# Altium project SynthyTwo.Project.PrjPcb
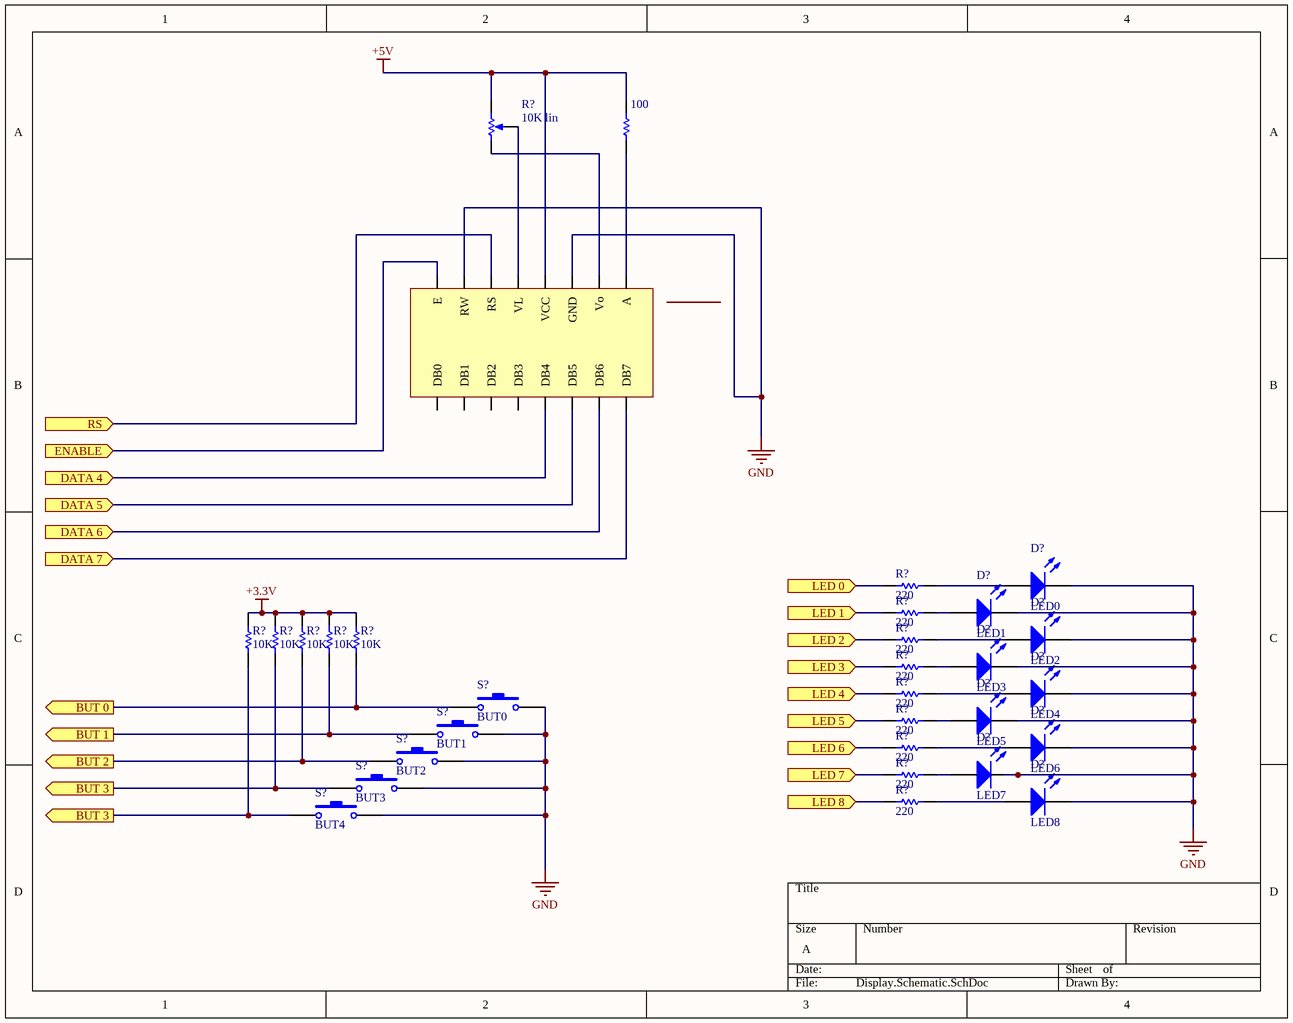
[diagram p0: Display.Schematic.SchDoc]
7 sheets, 207 parts. Net scope: flat (ports and power ports of the same name join across sheets).
Sheets:
  Display.Schematic.SchDoc
  FilterBoard.Schematic.SchDoc
  Output.Schematic.SchDoc
  FilterControl.Schematic.SchDoc
  DAC.Schematic.SchDoc
  MIDI.Schematic.SchDoc
  Encodeurs.Schematic.SchDoc

## Sheet Display.Schematic.SchDoc
size A

### Parts
(Parts that share a designator on the sheet are numbered #1, #2 ... from top to bottom, then left to right.)
*#1  16x2 LCD  (value not drawn)
D?#1  LED0  [LED-0]
D?#2  LED1  [LED-0]
D?#3  LED2  [LED-0]
D?#4  LED3  [LED-0]
D?#5  LED4  [LED-0]
D?#6  LED5  [LED-0]
D?#7  LED6  [LED-0]
D?#8  LED7  [LED-0]
D?#9  LED8  [LED-0]
R?#1  10K lin  [VR5]
R?#2  100  [AXIAL-0.3]
R?#3  220  [AXIAL-0.3]
R?#4  220  [AXIAL-0.3]
R?#5  220  [AXIAL-0.3]
R?#6  10K  [AXIAL-0.3]
R?#7  10K  [AXIAL-0.3]
R?#8  10K  [AXIAL-0.3]
R?#9  10K  [AXIAL-0.3]
R?#10  10K  [AXIAL-0.3]
R?#11  220  [AXIAL-0.3]
R?#12  220  [AXIAL-0.3]
R?#13  220  [AXIAL-0.3]
R?#14  220  [AXIAL-0.3]
R?#15  220  [AXIAL-0.3]
R?#16  220  [AXIAL-0.3]
S?#1  BUT0  [SPST-2]
S?#2  BUT1  [SPST-2]
S?#3  BUT2  [SPST-2]
S?#4  BUT3  [SPST-2]
S?#5  BUT4  [SPST-2]

### Ports
BUT 0 (out), BUT 1 (out), BUT 2 (out), BUT 3 (out), DATA 4 (in), DATA 5 (in), DATA 6 (in), DATA 7 (in), ENABLE (in), LED 0 (in), LED 1 (in), LED 2 (in), LED 3 (in), LED 4 (in), LED 5 (in), LED 6 (in), LED 7 (in), LED 8 (in), RS (in)

### Nets
+3.3V: R?#6.2 R?#7.2 R?#8.2 R?#9.2 R?#10.2
+5V: *#1.2(VCC) R?#1.2(BOT) R?#2.2
GND: *#1.1(GND) *#1.5(RW) D?#1.2(K) D?#2.2(K) D?#3.2(K) D?#4.2(K) D?#5.2(K) D?#6.2(K) D?#7.2(K) D?#8.2(K) D?#9.2(K) S?#1.2 S?#2.2 S?#3.2 S?#4.2 S?#5.2
Net*#1_3: *#1.3(VL) R?#1.3(TAP)
Net*#1_4: *#1.4(RS) ; port RS
Net*#1_6: *#1.6(E) ; port ENABLE
Net*#1_7: *#1.7(DB7) ; port DATA 7
Net*#1_8: *#1.8(DB6) ; port DATA 6
Net*#1_9: *#1.9(DB5) ; port DATA 5
Net*#1_10: *#1.10(DB4) ; port DATA 4
Net*#1_15: *#1.15(Vo) R?#1.1(TOP)
Net*#1_16: *#1.16(A) R?#2.1
NetD?#1_1: D?#1.1(A) R?#3.2
NetD?#2_1: D?#2.1(A) R?#4.2
NetD?#3_1: D?#3.1(A) R?#5.2
NetD?#4_1: D?#4.1(A) R?#11.2
NetD?#5_1: D?#5.1(A) R?#12.2
NetD?#6_1: D?#6.1(A) R?#13.2
NetD?#7_1: D?#7.1(A) R?#14.2
NetD?#8_1: D?#8.1(A) R?#15.2
NetD?#9_1: D?#9.1(A) R?#16.2
NetR?#3_1: R?#3.1 ; port LED 0
NetR?#4_1: R?#4.1 ; port LED 1
NetR?#5_1: R?#5.1 ; port LED 2
NetR?#6_1: R?#6.1 R?#7.1 S?#4.1 S?#5.1 ; port BUT 3
NetR?#8_1: R?#8.1 S?#3.1 ; port BUT 2
NetR?#9_1: R?#9.1 S?#2.1 ; port BUT 1
NetR?#10_1: R?#10.1 S?#1.1 ; port BUT 0
NetR?#11_1: R?#11.1 ; port LED 3
NetR?#12_1: R?#12.1 ; port LED 4
NetR?#13_1: R?#13.1 ; port LED 5
NetR?#14_1: R?#14.1 ; port LED 6
NetR?#15_1: R?#15.1 ; port LED 7
NetR?#16_1: R?#16.1 ; port LED 8

Not connected (* = marked no-connect by the designer): *#1 11(DB3) 12(DB2) 13(DB1) 14(DB0)

### Library data of the parts
*#1 = Display
D?#1-D?#9 = LED0: Typical INFRARED GaAs LED; Published: 8-Jun-2000; LatestRevisionDate: 08-Jul-2005; LatestRevisionNote: Mech Layer 1 removed.; PackageReference: LED-0; Publisher: Altium Limited; PackageDescription: LED; 2 Leads
R?#1 = RPot: Potentiometer; Sim Note: Enter the Resistance value and the set point into parameter fields.; Set Position: 0.5; Published: 8-Jun-2000; LatestRevisionDate: 17-Jul-2002; LatestRevisionNote: Re-released for DXP Platform.; PackageReference: VR5; Publisher: Altium Limited; PackageDescription: Variable Resistor, Thru-Hole; 3 Leads; Value: 10K
R?#2-R?#4 R?#6-R?#10 = Res1: Resistor; Value: 1K; Published: 8-Jun-2000; LatestRevisionDate: 17-Jul-2002; LatestRevisionNote: Re-released for DXP Platform.; PackageReference: AXIAL-0.3; Publisher: Altium Limited; PackageDescription: Axial Device, Thru-Hole; 2 Leads; 0.3 in Pin Spacing
R?#5 R?#11-R?#16 = Res1: Resistor; Published: 8-Jun-2000; LatestRevisionDate: 17-Jul-2002; LatestRevisionNote: Re-released for DXP Platform.; PackageReference: AXIAL-0.3; Publisher: Altium Limited; PackageDescription: Axial Device, Thru-Hole; 2 Leads; 0.3 in Pin Spacing; Value: 220
S?#1-S?#5 = SW-PB: Switch; Published: 24-Mar-1999; LatestRevisionDate: 17-Jul-2002; LatestRevisionNote: Re-released for DXP Platform.; PackageReference: SPST-2; Publisher: Altium Limited; PackageDescription: Switch; 2 Leads

## Sheet FilterBoard.Schematic.SchDoc
size B
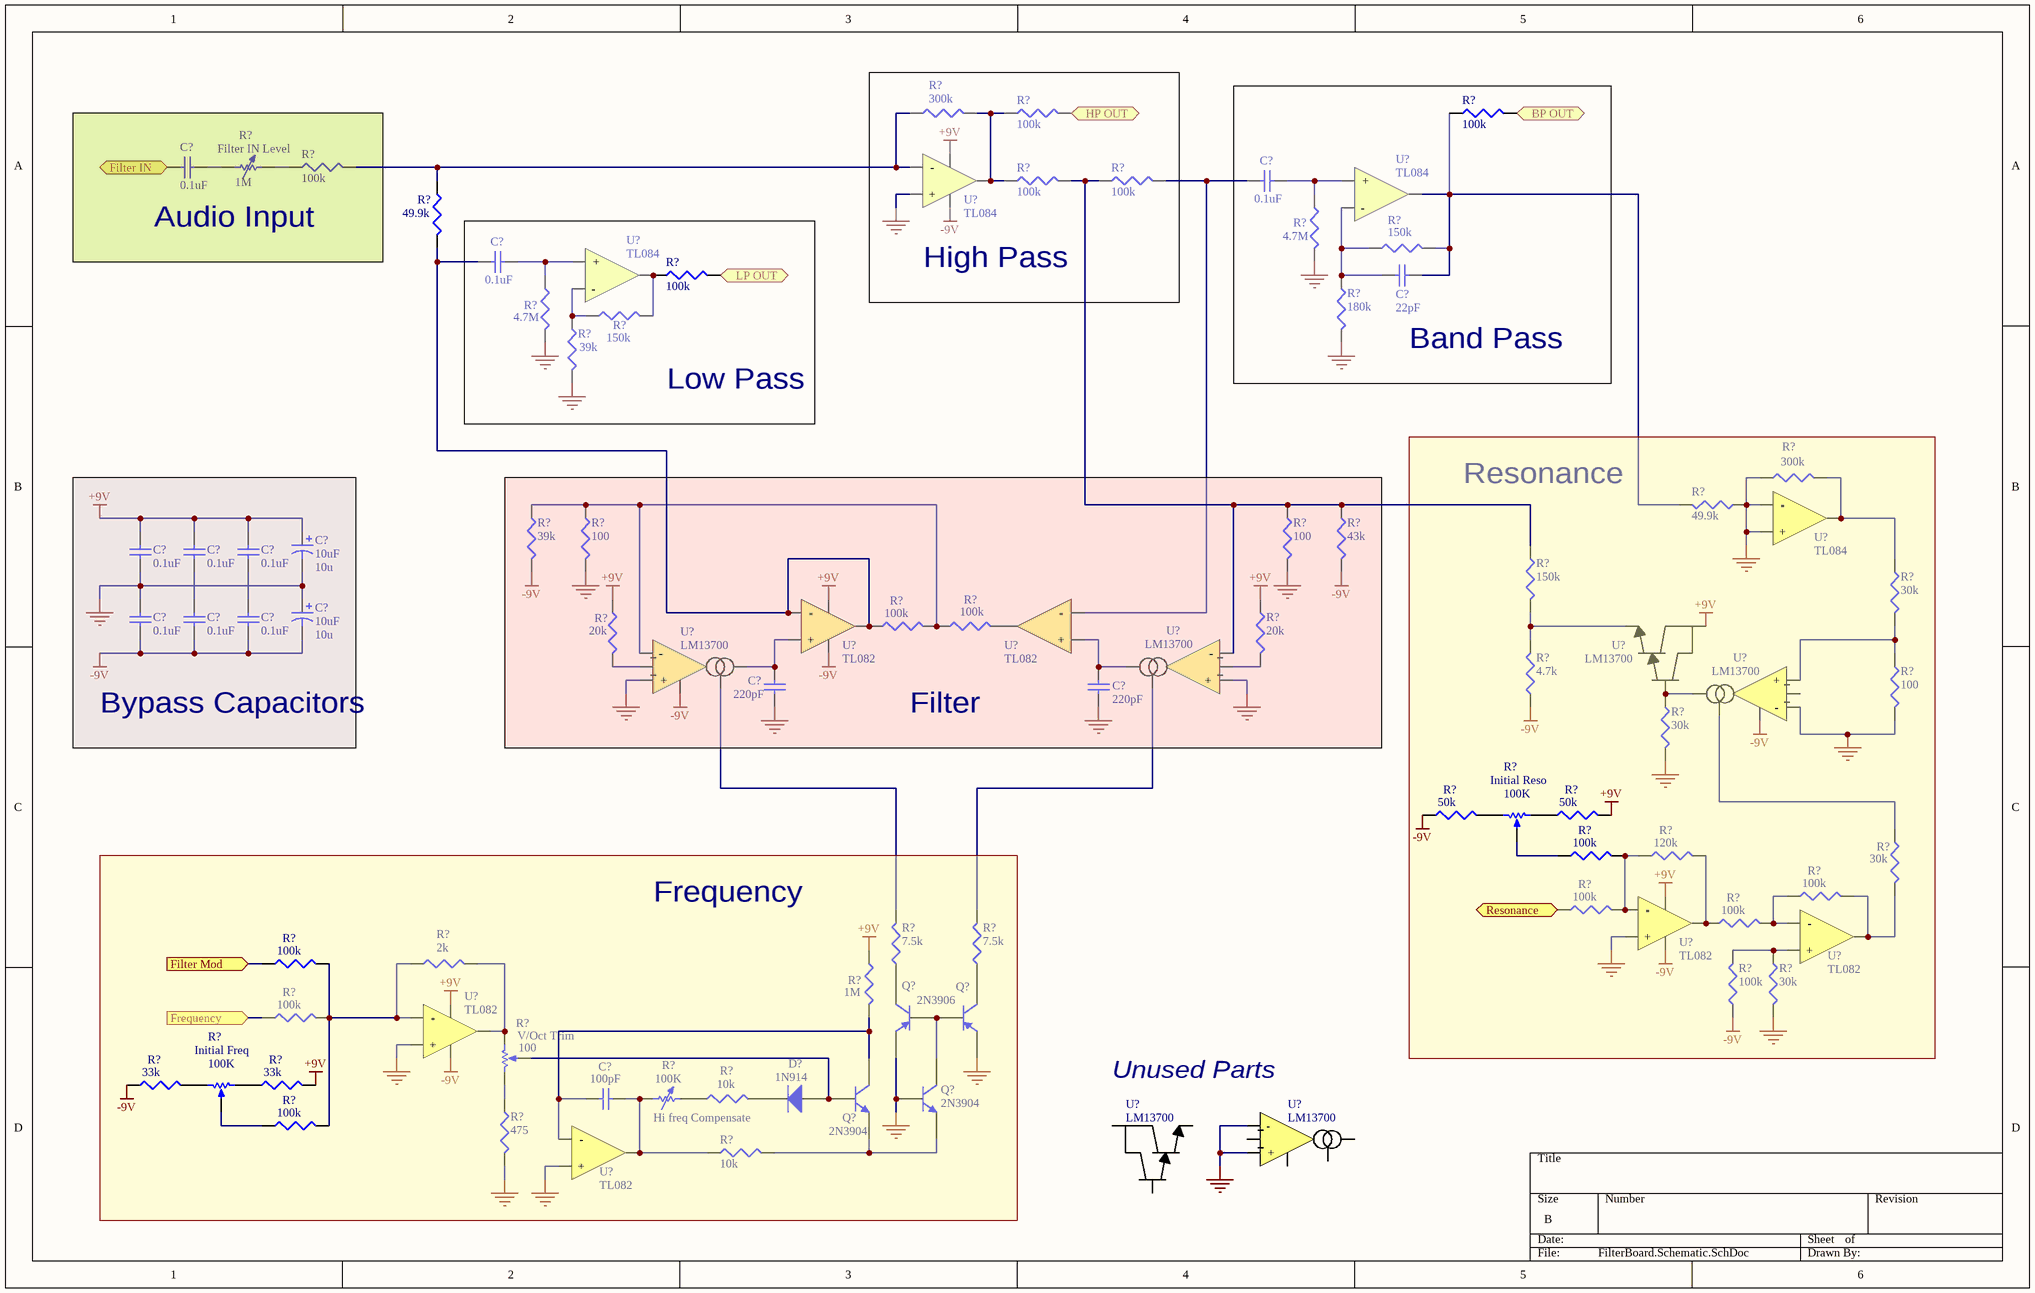
[diagram p1: FilterBoard.Schematic.SchDoc]

### Parts
(Parts that share a designator on the sheet are numbered #1, #2 ... from top to bottom, then left to right.)
C?#1  0.1uF  [C1206]
C?#2  0.1uF  [C1206]
C?#3  0.1uF  [C1206]
C?#4  22pF  [C1206]
C?#5  10uF  value 10u  [RB7.6-15]
C?#6  0.1uF  [C1206]
C?#7  0.1uF  [C1206]
C?#8  0.1uF  [C1206]
C?#9  10uF  value 10u  [RB7.6-15]
C?#10  0.1uF  [C1206]
C?#11  0.1uF  [C1206]
C?#12  0.1uF  [C1206]
C?#13  220pF  [C1206]
C?#14  220pF  [C1206]
C?#15  100pF  [C1206]
D?#10  1N914  [DO-41]
Q?#1  2N3906  [TO-92A]
Q?#2  2N3906  [TO-92A]  (value not drawn)
Q?#3  2N3904  [TO-92A]
Q?#4  2N3904  [TO-92A]
R?#17  300k  [J1-0603]
R?#18  100k  [J1-0603]
R?#19  100k  [J1-0603]
R?#20  Filter IN Level  value 1M  [AXIAL-0.7]
R?#21  100k  [J1-0603]
R?#22  100k  [J1-0603]
R?#23  100k  [J1-0603]
R?#24  49.9k  [J1-0603]
R?#25  4.7M  [J1-0603]
R?#26  150k  [J1-0603]
R?#27  100k  [J1-0603]
R?#28  4.7M  [J1-0603]
R?#29  180k  [J1-0603]
R?#30  150k  [J1-0603]
R?#31  39k  [J1-0603]
R?#32  300k  [J1-0603]
R?#33  39k  [J1-0603]
R?#34  100  [J1-0603]
R?#35  100  [J1-0603]
R?#36  43k  [J1-0603]
R?#37  49.9k  [J1-0603]
R?#38  150k  [J1-0603]
R?#39  30k  [J1-0603]
R?#40  20k  [J1-0603]
R?#41  100k  [J1-0603]
R?#42  100k  [J1-0603]
R?#43  20k  [J1-0603]
R?#44  100  [J1-0603]
R?#45  4.7k  [J1-0603]
R?#46  30k  [J1-0603]
R?#47  50k  [J1-0603]
R?#48  50k  [J1-0603]
R?#49  Initial Reso  value 100K  [VR5]
R?#50  100k  [J1-0603]
R?#51  120k  [J1-0603]
R?#52  30k  [J1-0603]
R?#53  100k  [J1-0603]
R?#54  100k  [J1-0603]
R?#55  100k  [J1-0603]
R?#56  100k  [J1-0603]
R?#57  2k  [J1-0603]
R?#58  7.5k  [J1-0603]
R?#59  1M  [J1-0603]
R?#60  7.5k  [J1-0603]
R?#61  30k  [J1-0603]
R?#62  100k  [J1-0603]
R?#63  100k  [J1-0603]
R?#64  V/Oct Trim  value 100  [VR5]
R?#65  33k  [J1-0603]
R?#66  33k  [J1-0603]
R?#67  Hi freq Compensate  value 100K  [AXIAL-0.7]
R?#68  10k  [J1-0603]
R?#69  Initial Freq  value 100K  [VR5]
R?#70  100k  [J1-0603]
R?#71  475  [J1-0603]
R?#72  10k  [J1-0603]
U?#1  TL084
U?#2  TL084
U?#3  TL084
U?#4  TL084
U?#5  TL082
U?#6  TL082
U?#7  LM13700
U?#8  LM13700
U?#9  LM13700
U?#10  LM13700
U?#11  TL082
U?#12  TL082
U?#13  TL082
U?#14  LM13700
U?#15  TL082
U?#16  LM13700

### Blocks framed on the sheet
Audio Input: C?#1 R?#20 R?#21
High Pass: R?#17 R?#18 R?#22 R?#23 U?#1
Band Pass: C?#2 C?#4 R?#19 R?#25 R?#26 R?#29 U?#2
Low Pass: C?#3 R?#27 R?#28 R?#30 R?#31 U?#3
Resonance: R?#32 R?#37-R?#39 R?#44-R?#55 R?#61 R?#63 U?#4 U?#9-U?#12
Bypass Capacitors: C?#5-C?#12
Filter: C?#13 C?#14 R?#33-R?#36 R?#40-R?#43 U?#5-U?#8
Frequency: C?#15 D?#10 Q?#1-Q?#4 R?#56-R?#60 R?#62 R?#64-R?#72 U?#13 U?#15

### Ports
BP OUT (out), Filter IN (in), Filter Mod (in), Frequency (in), HP OUT (out), LP OUT (out), Resonance (in)

### Nets
+9V: C?#5.1 C?#6.2 C?#7.2 C?#8.2 R?#40.1 R?#43.1 R?#48.2 R?#59.1 R?#66.2 U?#1.4(VCC+) U?#5.8(VCC+) U?#9.11(V+) U?#11.8(VCC+) U?#13.8(VCC+)
-9V: C?#9.2 C?#10.1 C?#11.1 C?#12.1 R?#33.2 R?#36.2 R?#45.1 R?#47.1 R?#63.1 R?#65.1 U?#1.11(VCC-) U?#5.4(VCC-) U?#7.6(VCC-) U?#10.6(VCC-) U?#11.4(VCC-) U?#13.4(VCC-)
GND: C?#5.2 C?#6.1 C?#9.1 C?#10.2 C?#13.1 C?#14.1 Q?#1.1(E) Q?#2.1(E) Q?#4.2(B) R?#25.2 R?#28.2 R?#29.2 R?#31.2 R?#32.1 R?#34.2 R?#35.2 R?#37.1 R?#44.2 R?#46.2 R?#61.2 R?#71.2 U?#1.3(+) U?#4.12(-) U?#4.13(+) U?#7.3(+) U?#8.3(+) U?#10.3(-) U?#11.3(+) U?#13.3(+) U?#14.3(+) U?#14.4(-) U?#15.5(+)
NetC?#1_1: C?#1.1 ; port Filter IN
NetC?#1_2: C?#1.2 R?#20.1
NetC?#2_1: C?#2.1 R?#23.2 U?#6.6(-)
NetC?#2_2: C?#2.2 R?#25.1 U?#2.5(+)
NetC?#3_1: C?#3.1 R?#24.2 R?#41.1 U?#5.1(OUT) U?#5.2(-)
NetC?#3_2: C?#3.2 R?#28.1 U?#3.5(+)
NetC?#4_1: C?#4.1 R?#26.1 R?#29.1 U?#2.3(-)
NetC?#4_2: C?#4.2 R?#19.1 R?#26.2 R?#37.2 U?#2.7(OUT)
NetC?#7_1: C?#7.1 C?#11.2
NetC?#8_1: C?#8.1 C?#12.2
NetC?#13_2: C?#13.2 U?#5.3(+) U?#7.5(OUT)
NetC?#14_2: C?#14.2 U?#6.5(+) U?#8.5(OUT)
NetC?#15_1: C?#15.1 Q?#3.3(C) R?#59.2 U?#15.6(-)
NetC?#15_2: C?#15.2 R?#67.1 R?#72.1 U?#15.7(OUT)
NetD?#10_1: D?#10.1(A) Q?#3.2(B) R?#64.3(TAP)
NetD?#10_2: D?#10.2(K) R?#68.2
NetQ?#1_2: Q?#1.2(B) Q?#2.2(B) Q?#4.3(C)
NetQ?#1_3: Q?#1.3(C) R?#58.1
NetQ?#2_3: Q?#2.3(C) R?#60.1
NetQ?#3_1: Q?#3.1(E) Q?#4.1(E) R?#72.2
NetR?#17_1: R?#17.1 R?#21.2 R?#24.1 U?#1.2(-)
NetR?#17_2: R?#17.2 R?#18.1 R?#22.1 U?#1.1(OUT)
NetR?#18_2: R?#18.2 ; port HP OUT
NetR?#19_2: R?#19.2 ; port BP OUT
NetR?#20_2: R?#20.2 R?#21.1
NetR?#22_2: R?#22.2 R?#23.1 R?#35.1 R?#36.1 R?#38.1 U?#8.4(-)
NetR?#27_1: R?#27.1 R?#30.2 U?#3.7(OUT)
NetR?#27_2: R?#27.2 ; port LP OUT
NetR?#30_1: R?#30.1 R?#31.1 U?#3.3(-)
NetR?#32_2: R?#32.2 R?#39.1 U?#4.14(OUT)
NetR?#33_1: R?#33.1 R?#34.1 R?#41.2 R?#42.1 U?#7.4(-)
NetR?#38_2: R?#38.2 R?#45.2 U?#9.8(BOUT)
NetR?#39_2: R?#39.2 R?#44.1 U?#10.4(+)
NetR?#40_2: R?#40.2 U?#7.2
NetR?#42_2: R?#42.2 U?#6.7(OUT)
NetR?#43_2: R?#43.2 U?#8.2
NetR?#46_1: R?#46.1 U?#9.7(BIN) U?#10.5(OUT)
NetR?#47_2: R?#47.2 R?#49.2(BOT)
NetR?#48_1: R?#48.1 R?#49.1(TOP)
NetR?#49_3: R?#49.3(TAP) R?#50.1
NetR?#50_2: R?#50.2 R?#51.1 R?#54.2 U?#11.2(-)
NetR?#51_2: R?#51.2 R?#55.1 U?#11.1(OUT)
NetR?#52_1: R?#52.1 U?#10.1(BIAS)
NetR?#52_2: R?#52.2 R?#53.2 U?#12.7(OUT)
NetR?#53_1: R?#53.1 R?#55.2 U?#12.6(-)
NetR?#54_1: R?#54.1 ; port Resonance
NetR?#56_1: R?#56.1 ; port Filter Mod
NetR?#56_2: R?#56.2 R?#57.1 R?#62.2 R?#70.2 U?#13.2(-)
NetR?#57_2: R?#57.2 R?#64.1(TOP) U?#13.1(OUT)
NetR?#58_2: R?#58.2 U?#7.1(BIAS)
NetR?#60_2: R?#60.2 U?#8.1(BIAS)
NetR?#61_1: R?#61.1 R?#63.2 U?#12.5(+)
NetR?#62_1: R?#62.1 ; port Frequency
NetR?#64_2: R?#64.2(BOT) R?#71.1
NetR?#65_2: R?#65.2 R?#69.2(BOT)
NetR?#66_1: R?#66.1 R?#69.1(TOP)
NetR?#67_2: R?#67.2 R?#68.1
NetR?#69_3: R?#69.3(TAP) R?#70.1

Not connected (* = marked no-connect by the designer): U?#2 6(VCC+) 11(VCC-); U?#3 6(VCC+) 11(VCC-); U?#4 1(VCC+) 11(VCC-); U?#6 4(VCC-) 8(VCC+); U?#8 6(VCC-); U?#10 2; U?#12 4(VCC-) 8(VCC+); U?#14 1(BIAS) 2 5(OUT) 6(VCC-); U?#15 4(VCC-) 8(VCC+); U?#16 7(BIN) 8(BOUT) 11(V+)

### Notes on the sheet
- (near U?#16) Unused Parts

### Library data of the parts
C?#1-C?#3 C?#6-C?#8 C?#10-C?#12 = Cap Semi: Capacitor (Semiconductor SIM Model); Value: 0.1u; Published: 8-Jun-2000; LatestRevisionDate: 29-May-2009; LatestRevisionNote: IPC-7351 Footprint Added.; PackageReference: C1206; Publisher: Altium Limited; PackageDescription: Chip Capacitor
C?#4 = Cap Semi: Capacitor (Semiconductor SIM Model); Value: 22p; Published: 8-Jun-2000; LatestRevisionDate: 29-May-2009; LatestRevisionNote: IPC-7351 Footprint Added.; PackageReference: C1206; Publisher: Altium Limited; PackageDescription: Chip Capacitor
C?#5 C?#9 = Cap Pol1: Polarized Capacitor (Radial); Published: 8-Jun-2000; LatestRevisionDate: 17-Jul-2002; LatestRevisionNote: Re-released for DXP Platform.; PackageReference: RB7.6-15; Publisher: Altium Limited; PackageDescription: Polarized Capacitor (Radial); 2 Leads
C?#13 C?#14 = Cap Semi: Capacitor (Semiconductor SIM Model); Value: 220p; Published: 8-Jun-2000; LatestRevisionDate: 29-May-2009; LatestRevisionNote: IPC-7351 Footprint Added.; PackageReference: C1206; Publisher: Altium Limited; PackageDescription: Chip Capacitor
C?#15 = Cap Semi: Capacitor (Semiconductor SIM Model); Value: 100p; Published: 8-Jun-2000; LatestRevisionDate: 29-May-2009; LatestRevisionNote: IPC-7351 Footprint Added.; PackageReference: C1206; Publisher: Altium Limited; PackageDescription: Chip Capacitor
D?#10 = Diode 1N4001: 1 Amp General Purpose Rectifier; Published: 8-Jun-2000; LatestRevisionDate: 17-Jul-2002; LatestRevisionNote: Re-released for DXP Platform.; DatasheetVersion: 1998; PackageVersion: Aug-1999; PackageReference: DO-41; Publisher: Altium Limited; PackageDescription: Diode, Axial; Body 5.2 x 2.7 mm (LxDia. max), Lead Dia. 0.86 mm (max); Code_JEDEC: DO-204-AL; ComponentLink1Description: Manufacturer Link; ComponentLink1URL: http://www.fairchildsemi.com/; ComponentLink2Description: Datasheet; ComponentLink2URL: http://www.fairchildsemi.com/ds/1N%2F1N4001.pdf
Q?#1 Q?#2 = 2N3906: PNP General Purpose Amplifier; Published: 8-Jun-2000; LatestRevisionDate: 15-Jan-2003; LatestRevisionNote: PCB Footprint 'BCY-W3/D4.7' replaced; DatasheetVersion: 1997; PackageVersion: Sep-1998; PackageReference: TO-92A; Publisher: Altium Limited; PackageDescription: TO, Flat Index; 3 In-Line, Axial Leads; Body Dia. 4.5mm; Leads 0.51 x 0.48 mm (max); ComponentLink1Description: Manufacturer Link; ComponentLink1URL: http://www.fairchildsemi.com/; ComponentLink2Description: Datasheet; ComponentLink2URL: http://www.fairchildsemi.com/ds/2N%2F2N3906.pdf
Q?#3 Q?#4 = 2N3904: NPN General Purpose Amplifier; Published: 8-Jun-2000; LatestRevisionDate: 15-Jan-2003; LatestRevisionNote: PCB Footprint 'BCY-W3/D4.7' replaced; DatasheetVersion: 1997; PackageVersion: Sep-1998; PackageReference: TO-92A; Publisher: Altium Limited; PackageDescription: TO, Flat Index; 3 In-Line, Axial Leads; Body Dia. 4.5mm; Leads 0.51 x 0.48 mm (max); ComponentLink1Description: Manufacturer Link; ComponentLink1URL: http://www.fairchildsemi.com/; ComponentLink2Description: Datasheet; ComponentLink2URL: http://www.fairchildsemi.com/ds/2N%2F2N3904.pdf
R?#17-R?#19 R?#21-R?#48 R?#50-R?#63 R?#65 R?#66 R?#68 R?#70-R?#72 = Res3: Resistor; Published: 8-Jun-2000; LatestRevisionDate: 29-May-2009; LatestRevisionNote: IPC-7351 Footprint Added.; PackageReference: J1-0603; Publisher: Altium Limited; PackageDescription: Chip Resistor
  R?#17 R?#32: Value: 300K
  R?#18 R?#19 R?#21-R?#23 R?#27 R?#41 R?#42 R?#50 R?#53-R?#56 R?#62 R?#63 R?#70: Value: 100K
  R?#24 R?#37: Value: 49.9K
  R?#25 R?#28: Value: 4.7M
  R?#26 R?#30 R?#38: Value: 150K
  R?#29: Value: 180K
  R?#31 R?#33: Value: 39K
  R?#34 R?#35 R?#44: Value: 100
  R?#36: Value: 43K
  R?#39 R?#46 R?#52 R?#61: Value: 30K
  R?#40 R?#43: Value: 20K
  R?#45: Value: 4.7K
  R?#47 R?#48: Value: 50K
  R?#51: Value: 120K
  R?#57: Value: 2K
  R?#58 R?#60: Value: 7.5K
  R?#59: Value: 1M
  R?#65 R?#66: Value: 33K
  R?#68 R?#72: Value: 10K
  R?#71: Value: 475
R?#20 R?#67 = Res Adj1: Variable Resistor; Set Position: 0.5; Published: 8-Jun-2000; LatestRevisionDate: 17-Jul-2002; LatestRevisionNote: Re-released for DXP Platform.; PackageReference: AXIAL-0.7; Publisher: Altium Limited; PackageDescription: Axial Device, Thru-Hole; 2 Leads; 0.7 in Pin Spacing
R?#49 R?#64 R?#69 = RPot: as R?#1 on sheet Display.Schematic; Published: 8-Jun-2000; LatestRevisionDate: 17-Jul-2002; LatestRevisionNote: Re-released for DXP Platform.; PackageReference: VR5; Publisher: Altium Limited; PackageDescription: Variable Resistor, Thru-Hole; 3 Leads
U?#9 U?#16 = LM13700_1

## Sheet Output.Schematic.SchDoc
size A
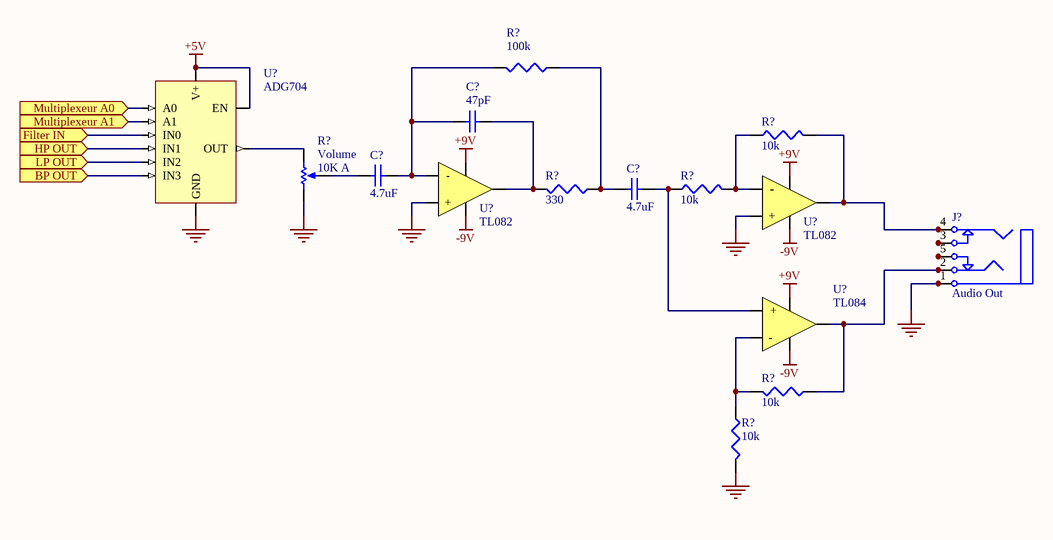
[diagram p2: Output.Schematic.SchDoc]

### Parts
(Parts that share a designator on the sheet are numbered #1, #2 ... from top to bottom, then left to right.)
C?#16  47pF  [C1206]
C?#17  4.7uF  [C1206]
C?#18  4.7uF  [C1206]
J?  Audio Out  [ST-3150-5N]
R?#73  100k  [J1-0603]
R?#74  10k  [J1-0603]
R?#75  10k  [J1-0603]
R?#76  Volume  value 10K A  [VR5]
R?#77  330  [J1-0603]
R?#78  10k  [J1-0603]
R?#79  10k  [J1-0603]
U?#17  ADG704
U?#18  TL082
U?#19  TL082
U?#20  TL084

### Ports
BP OUT (in), Filter IN (in), HP OUT (in), LP OUT (in), Multiplexeur A0 (in), Multiplexeur A1 (in)

### Nets
+5V: U?#17.5(EN) U?#17.6(V+)
+9V: U?#18.8(VCC+) U?#19.8(VCC+) U?#20.4(VCC+)
-9V: U?#18.4(VCC-) U?#19.4(VCC-) U?#20.11(VCC-)
GND: J?.1 J?.1A J?.1B R?#76.1(TOP) R?#79.2 U?#17.3(GND) U?#18.3(+) U?#19.3(+)
NetC?#1_1: U?#17.2(IN0) ; port Filter IN
NetC?#16_1: C?#16.1 C?#17.2 R?#73.2 U?#18.2(-)
NetC?#16_2: C?#16.2 R?#77.2 U?#18.1(OUT)
NetC?#17_1: C?#17.1 R?#76.3(TAP)
NetC?#18_1: C?#18.1 R?#73.1 R?#77.1
NetC?#18_2: C?#18.2 R?#75.1 U?#20.2(+)
NetJ?_2: J?.2 J?.2A J?.2B R?#78.1 U?#20.1(OUT)
NetJ?_3: J?.3 J?.3A J?.3B
NetJ?_4: J?.4 J?.4A J?.4B R?#74.2 U?#19.1(OUT)
NetJ?_5: J?.5 J?.5A J?.5B
NetR?#18_2: U?#17.9(IN1) ; port HP OUT
NetR?#19_2: U?#17.7(IN3) ; port BP OUT
NetR?#27_2: U?#17.4(IN2) ; port LP OUT
NetR?#74_1: R?#74.1 R?#75.2 U?#19.2(-)
NetR?#76_2: R?#76.2(BOT) U?#17.8(OUT)
NetR?#78_2: R?#78.2 R?#79.1 U?#20.3(-)
NetU?#17_1: U?#17.1(A0) ; port Multiplexeur A0
NetU?#17_10: U?#17.10(A1) ; port Multiplexeur A1

### Library data of the parts
C?#16 = Cap Semi: Capacitor (Semiconductor SIM Model); Published: 8-Jun-2000; LatestRevisionDate: 29-May-2009; LatestRevisionNote: IPC-7351 Footprint Added.; PackageReference: C1206; Publisher: Altium Limited; PackageDescription: Chip Capacitor; Value: 47pF
C?#17 C?#18 = Cap Semi: Capacitor (Semiconductor SIM Model); Value: 4.7u; Published: 8-Jun-2000; LatestRevisionDate: 29-May-2009; LatestRevisionNote: IPC-7351 Footprint Added.; PackageReference: C1206; Publisher: Altium Limited; PackageDescription: Chip Capacitor
J? = Phonejack Stereo SW: 3-Conductor Jack with 2 break contacts (normals) and 2 auxiliary make contacts; Published: 5-Jan-2004; LatestRevisionDate: 17-Dec-2003; LatestRevisionNote: PCB Footprint replaced.; DatasheetDocument: 07-Mar-2000; Publisher: Altium Limited; ComponentLink1Description: Manufacturer Link; ComponentLink1URL: http://domino.kycon.com/internet/Products.html
R?#73-R?#75 R?#77-R?#79 = Res3: Resistor; Published: 8-Jun-2000; LatestRevisionDate: 29-May-2009; LatestRevisionNote: IPC-7351 Footprint Added.; PackageReference: J1-0603; Publisher: Altium Limited; PackageDescription: Chip Resistor
  R?#73: Value: 100K
  R?#74 R?#75 R?#78 R?#79: Value: 10K
  R?#77: Value: 330
R?#76 = RPot: as R?#1 on sheet Display.Schematic; Published: 8-Jun-2000; LatestRevisionDate: 17-Jul-2002; LatestRevisionNote: Re-released for DXP Platform.; PackageReference: VR5; Publisher: Altium Limited; PackageDescription: Variable Resistor, Thru-Hole; 3 Leads

## Sheet FilterControl.Schematic.SchDoc
size A
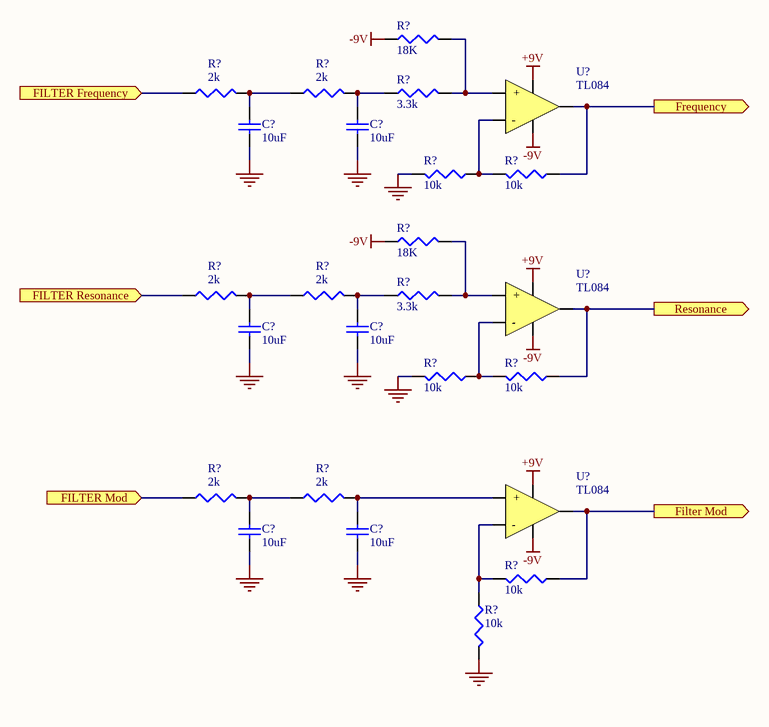
[diagram p3: FilterControl.Schematic.SchDoc]

### Parts
(Parts that share a designator on the sheet are numbered #1, #2 ... from top to bottom, then left to right.)
C?#19  10uF  [C1206]
C?#20  10uF  [C1206]
C?#21  10uF  [C1206]
C?#22  10uF  [C1206]
C?#23  10uF  [C1206]
C?#24  10uF  [C1206]
R?#80  18K  [J1-0603]
R?#81  2k  [J1-0603]
R?#82  2k  [J1-0603]
R?#83  3.3k  [J1-0603]
R?#84  10k  [J1-0603]
R?#85  10k  [J1-0603]
R?#86  18K  [J1-0603]
R?#87  2k  [J1-0603]
R?#88  2k  [J1-0603]
R?#89  3.3k  [J1-0603]
R?#90  10k  [J1-0603]
R?#91  10k  [J1-0603]
R?#92  2k  [J1-0603]
R?#93  2k  [J1-0603]
R?#94  10k  [J1-0603]
R?#95  10k  [J1-0603]
U?#21  TL084
U?#22  TL084
U?#23  TL084

### Ports
FILTER Frequency (in), FILTER Mod (in), Filter Mod (out), FILTER Resonance (in), Frequency (out), Resonance (out)

### Nets
+9V: U?#21.4(VCC+) U?#22.4(VCC+) U?#23.4(VCC+)
-9V: R?#80.1 R?#86.1 U?#21.11(VCC-) U?#22.11(VCC-) U?#23.11(VCC-)
GND: C?#19.1 C?#20.1 C?#21.1 C?#22.1 C?#23.1 C?#24.1 R?#84.2 R?#90.2 R?#95.2
NetC?#19_2: C?#19.2 R?#81.2 R?#82.1
NetC?#20_2: C?#20.2 R?#82.2 R?#83.1
NetC?#21_2: C?#21.2 R?#87.2 R?#88.1
NetC?#22_2: C?#22.2 R?#88.2 R?#89.1
NetC?#23_2: C?#23.2 R?#92.2 R?#93.1
NetC?#24_2: C?#24.2 R?#93.2 U?#23.2(+)
NetR?#54_1: R?#91.1 U?#22.1(OUT) ; port Resonance
NetR?#56_1: R?#92.1 R?#94.1 U?#23.1(OUT) ; port Filter Mod, port FILTER Mod
NetR?#62_1: R?#85.1 U?#21.1(OUT) ; port Frequency
NetR?#80_2: R?#80.2 R?#83.2 U?#21.2(+)
NetR?#81_1: R?#81.1 ; port FILTER Frequency
NetR?#84_1: R?#84.1 R?#85.2 U?#21.3(-)
NetR?#86_2: R?#86.2 R?#89.2 U?#22.2(+)
NetR?#87_1: R?#87.1 ; port FILTER Resonance
NetR?#90_1: R?#90.1 R?#91.2 U?#22.3(-)
NetR?#94_2: R?#94.2 R?#95.1 U?#23.3(-)

### Library data of the parts
C?#19-C?#24 = Cap Semi: Capacitor (Semiconductor SIM Model); Value: 10u; Published: 8-Jun-2000; LatestRevisionDate: 29-May-2009; LatestRevisionNote: IPC-7351 Footprint Added.; PackageReference: C1206; Publisher: Altium Limited; PackageDescription: Chip Capacitor
R?#80-R?#95 = Res3: Resistor; Published: 8-Jun-2000; LatestRevisionDate: 29-May-2009; LatestRevisionNote: IPC-7351 Footprint Added.; PackageReference: J1-0603; Publisher: Altium Limited; PackageDescription: Chip Resistor
  R?#80 R?#86: Value: 18K
  R?#81 R?#82 R?#87 R?#88 R?#92 R?#93: Value: 2K
  R?#83 R?#89: Value: 3.3K
  R?#84 R?#85 R?#90 R?#91 R?#94 R?#95: Value: 10K

## Sheet DAC.Schematic.SchDoc
size A
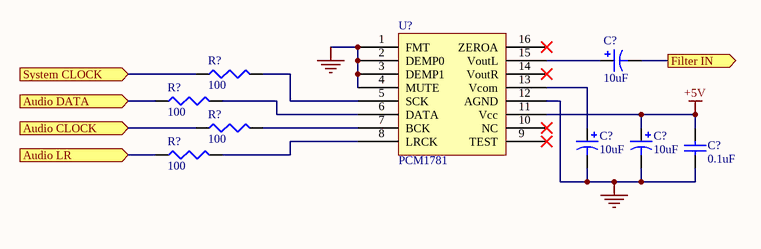
[diagram p4: DAC.Schematic.SchDoc]

### Parts
(Parts that share a designator on the sheet are numbered #1, #2 ... from top to bottom, then left to right.)
C?#25  10uF  [RB7.6-15]
C?#26  10uF  [RB7.6-15]
C?#27  10uF  [RB7.6-15]
C?#28  0.1uF  [C1206]
R?#96  100  [J1-0603]
R?#97  100  [J1-0603]
R?#98  100  [J1-0603]
R?#99  100  [J1-0603]
U?#24  PCM1781

### Ports
Audio CLOCK (in), Audio DATA (in), Audio LR (in), Filter IN (out), System CLOCK (in)

### Nets
+5V: C?#27.1 C?#28.2 U?#24.11(Vcc)
NetC?#26_2: C?#26.2 C?#27.2 C?#28.1 U?#24.1(FMT) U?#24.2(DEMP0) U?#24.3(DEMP1) U?#24.4(MUTE) U?#24.12(AGND)
NetC?#1_1: C?#25.2 ; port Filter IN
NetC?#25_1: C?#25.1 U?#24.15(VoutL)
NetC?#26_1: C?#26.1 U?#24.13(Vcom)
NetR?#96_1: R?#96.1 ; port System CLOCK
NetR?#96_2: R?#96.2 U?#24.5(SCK)
NetR?#97_1: R?#97.1 ; port Audio DATA
NetR?#97_2: R?#97.2 U?#24.6(DATA)
NetR?#98_1: R?#98.1 ; port Audio CLOCK
NetR?#98_2: R?#98.2 U?#24.7(BCK)
NetR?#99_1: R?#99.1 ; port Audio LR
NetR?#99_2: R?#99.2 U?#24.8(LRCK)

Not connected (* = marked no-connect by the designer): U?#24 9(TEST)* 10(NC)* 14(VoutR)* 16(ZEROA)*

### Library data of the parts
C?#25-C?#27 = Cap Pol1: Polarized Capacitor (Radial); Published: 8-Jun-2000; LatestRevisionDate: 17-Jul-2002; LatestRevisionNote: Re-released for DXP Platform.; PackageReference: RB7.6-15; Publisher: Altium Limited; PackageDescription: Polarized Capacitor (Radial); 2 Leads; Value: 10uF
C?#28 = Cap Semi: as C?#1 on sheet FilterBoard.Schematic; Published: 8-Jun-2000; LatestRevisionDate: 29-May-2009; LatestRevisionNote: IPC-7351 Footprint Added.; PackageReference: C1206; Publisher: Altium Limited; PackageDescription: Chip Capacitor
R?#96-R?#99 = Res3: Resistor; Published: 8-Jun-2000; LatestRevisionDate: 29-May-2009; LatestRevisionNote: IPC-7351 Footprint Added.; PackageReference: J1-0603; Publisher: Altium Limited; PackageDescription: Chip Resistor; Value: 100
U?#24 = PCM1781 DAC

## Sheet MIDI.Schematic.SchDoc
size A
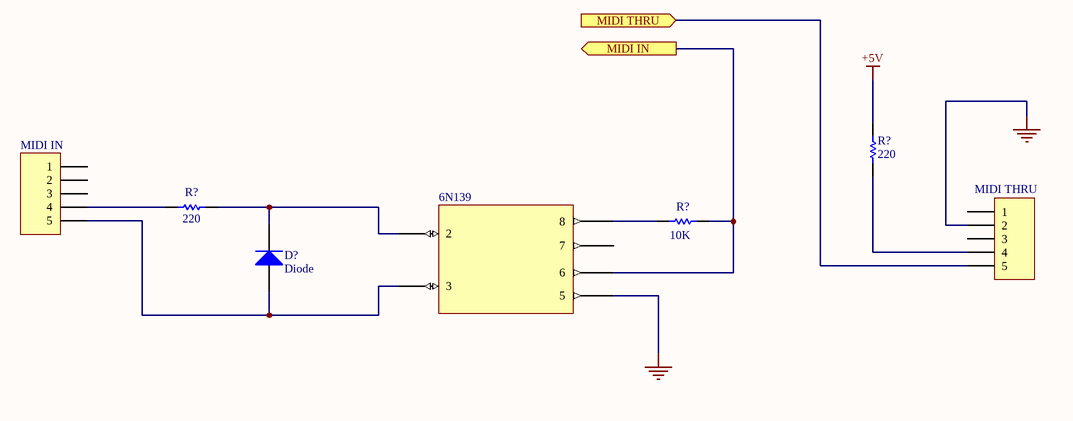
[diagram p5: MIDI.Schematic.SchDoc]

### Parts
(Parts that share a designator on the sheet are numbered #1, #2 ... from top to bottom, then left to right.)
6N139  6N139  (value not drawn)
D?#11  Diode  [SMC]
MIDI_IN  Header 5  [HDR1X5]  (value not drawn)
MIDI_THRU  Header 5  [HDR1X5]  (value not drawn)
R?#100  value 220  [AXIAL-0.3]  (hidden comment: Res1)
R?#101  value 220  [AXIAL-0.3]  (hidden comment: Res1)
R?#102  value 10K  [AXIAL-0.3]  (hidden comment: Res1)

### Ports
MIDI IN (out), MIDI THRU (in)

### Nets
+5V: R?#100.2
GND: 6N139.?4(5) MIDI_THRU.2
Net6N139_?1: 6N139.?1(3) D?#11.1(A) MIDI_IN.5
Net6N139_?2: 6N139.?2(2) D?#11.2(K) R?#101.2
Net6N139_?3: 6N139.?3(8) R?#102.1
Net6N139_?6: 6N139.?6(6) R?#102.2 ; port MIDI IN
NetMIDI_IN_4: MIDI_IN.4 R?#101.1
NetMIDI_THRU_4: MIDI_THRU.4 R?#100.1
NetMIDI_THRU_5: MIDI_THRU.5 ; port MIDI THRU

Not connected (* = marked no-connect by the designer): 6N139 ?5(7); MIDI_IN 1 2 3; MIDI_THRU 1 3

### Library data of the parts
D?#11 = Diode: Default Diode; Published: 8-Jun-2000; LatestRevisionDate: 17-Jul-2002; LatestRevisionNote: Re-released for DXP Platform.; PackageVersion: Sep-1996; PackageReference: SMC; Publisher: Altium Limited; PackageDescription: DO-214-AB/SMC; 2 C-Bend Leads; Body 7.9 x 5.9 mm, inc. leads (LxW); Code_JEDEC: DO-214-AB
MIDI_IN MIDI_THRU = Header 5: DIN 5 Pins; LatestRevisionDate: 17-Jul-2002; LatestRevisionNote: Re-released for DXP Platform.; Publisher: Altium Limited
R?#100-R?#102 = Res1: Resistor; Published: 8-Jun-2000; LatestRevisionDate: 17-Jul-2002; LatestRevisionNote: Re-released for DXP Platform.; PackageReference: AXIAL-0.3; Publisher: Altium Limited; PackageDescription: Axial Device, Thru-Hole; 2 Leads; 0.3 in Pin Spacing

## Sheet Encodeurs.Schematic.SchDoc
size A
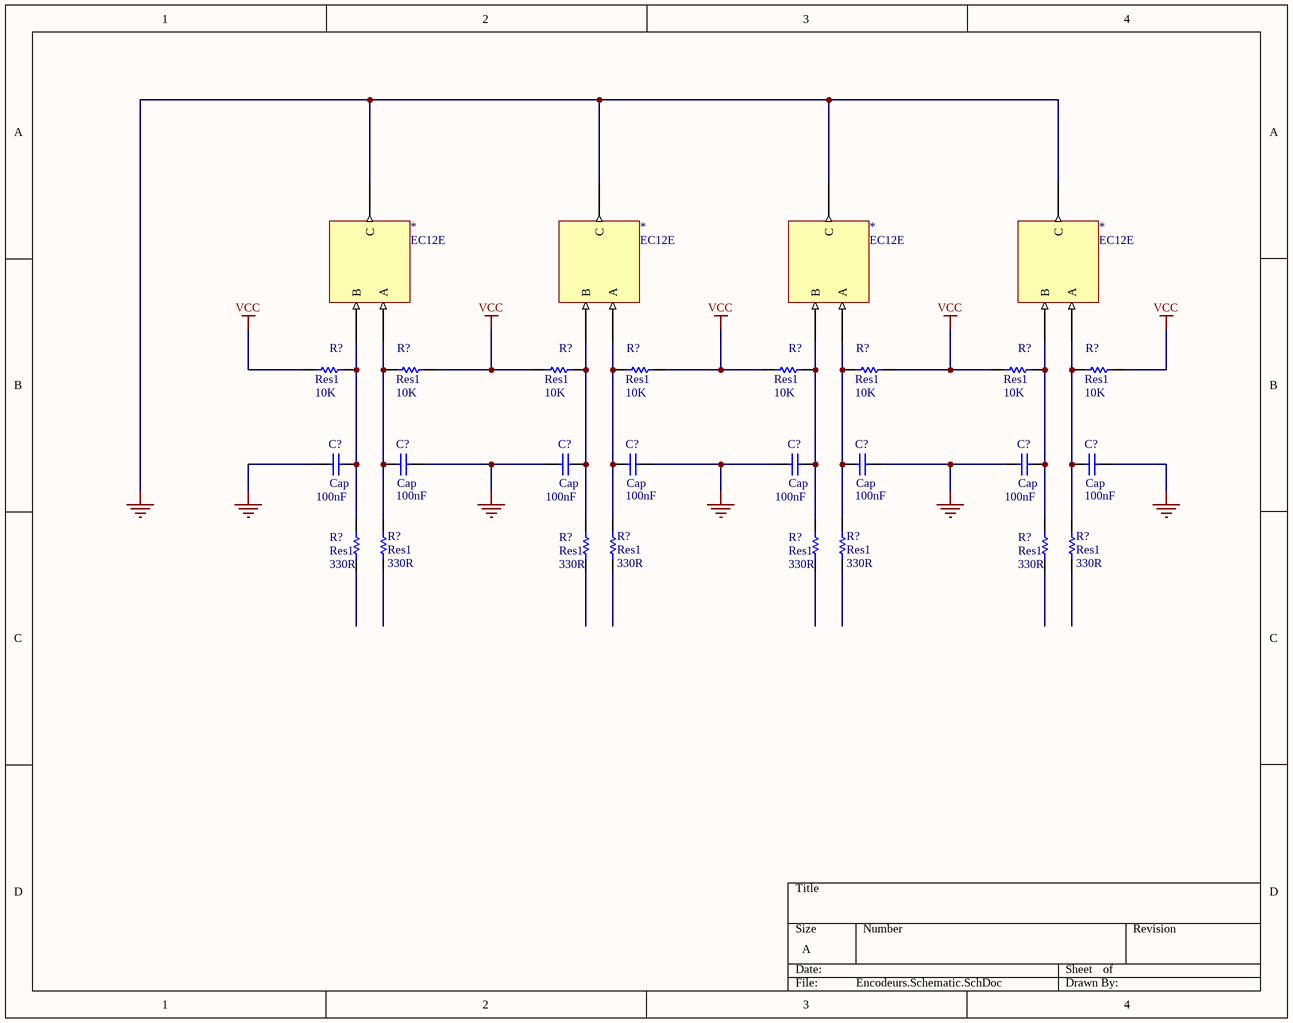
[diagram p6: Encodeurs.Schematic.SchDoc]

### Parts
(Parts that share a designator on the sheet are numbered #1, #2 ... from top to bottom, then left to right.)
*#2  EC12E
*#3  EC12E
*#4  EC12E
*#5  EC12E
C?#29  Cap  value 100nF  [RAD-0.3]
C?#30  Cap  value 100nF  [RAD-0.3]
C?#31  Cap  value 100nF  [RAD-0.3]
C?#32  Cap  value 100nF  [RAD-0.3]
C?#33  Cap  value 100nF  [RAD-0.3]
C?#34  Cap  value 100nF  [RAD-0.3]
C?#35  Cap  value 100nF  [RAD-0.3]
C?#36  Cap  value 100nF  [RAD-0.3]
R?#103  Res1  value 10K  [AXIAL-0.3]
R?#104  Res1  value 10K  [AXIAL-0.3]
R?#105  Res1  value 10K  [AXIAL-0.3]
R?#106  Res1  value 10K  [AXIAL-0.3]
R?#107  Res1  value 10K  [AXIAL-0.3]
R?#108  Res1  value 10K  [AXIAL-0.3]
R?#109  Res1  value 10K  [AXIAL-0.3]
R?#110  Res1  value 10K  [AXIAL-0.3]
R?#111  Res1  value 330R  [AXIAL-0.3]
R?#112  Res1  value 330R  [AXIAL-0.3]
R?#113  Res1  value 330R  [AXIAL-0.3]
R?#114  Res1  value 330R  [AXIAL-0.3]
R?#115  Res1  value 330R  [AXIAL-0.3]
R?#116  Res1  value 330R  [AXIAL-0.3]
R?#117  Res1  value 330R  [AXIAL-0.3]
R?#118  Res1  value 330R  [AXIAL-0.3]

### Nets
GND: *#2.GND(C) *#3.GND(C) *#4.GND(C) *#5.GND(C) C?#29.1 C?#30.1 C?#31.1 C?#32.1 C?#33.1 C?#34.1 C?#35.1 C?#36.1
VCC: R?#103.2 R?#104.2 R?#105.2 R?#106.2 R?#107.2 R?#108.2 R?#109.2 R?#110.2
Net*#2_Pin A: *#2.Pin_A(A) C?#33.2 R?#103.1 R?#111.1
Net*#2_Pin B: *#2.Pin_B(B) C?#29.2 R?#107.1 R?#115.2
Net*#3_Pin A: *#3.Pin_A(A) C?#34.2 R?#104.1 R?#112.1
Net*#3_Pin B: *#3.Pin_B(B) C?#30.2 R?#108.1 R?#116.2
Net*#4_Pin A: *#4.Pin_A(A) C?#35.2 R?#105.1 R?#113.1
Net*#4_Pin B: *#4.Pin_B(B) C?#31.2 R?#109.1 R?#117.2
Net*#5_Pin A: *#5.Pin_A(A) C?#36.2 R?#106.1 R?#114.1
Net*#5_Pin B: *#5.Pin_B(B) C?#32.2 R?#110.1 R?#118.2

Not connected (* = marked no-connect by the designer): R?#111 2; R?#112 2; R?#113 2; R?#114 2; R?#115 1; R?#116 1; R?#117 1; R?#118 1

### Library data of the parts
C?#29-C?#36 = Cap: Capacitor; Published: 8-Jun-2000; LatestRevisionDate: 17-Jul-2002; LatestRevisionNote: Re-released for DXP Platform.; PackageReference: RAD-0.3; Publisher: Altium Limited; PackageDescription: Radial Cap, Thru-Hole; 2 Leads; 0.3 in Pin Spacing
R?#103-R?#118 = Res1: Resistor; Published: 8-Jun-2000; LatestRevisionDate: 17-Jul-2002; LatestRevisionNote: Re-released for DXP Platform.; PackageReference: AXIAL-0.3; Publisher: Altium Limited; PackageDescription: Axial Device, Thru-Hole; 2 Leads; 0.3 in Pin Spacing

## Nets that join several sheets
+5V: Display.Schematic (*#1.2 R?#1.2 R?#2.2), Output.Schematic (U?#17.5 U?#17.6), DAC.Schematic (C?#27.1 C?#28.2 U?#24.11), MIDI.Schematic (R?#100.2)
+9V: FilterBoard.Schematic (14 pins), Output.Schematic (U?#18.8 U?#19.8 U?#20.4), FilterControl.Schematic (U?#21.4 U?#22.4 U?#23.4)
-9V: FilterBoard.Schematic (16 pins), Output.Schematic (U?#18.4 U?#19.4 U?#20.11), FilterControl.Schematic (5 pins)
GND: Display.Schematic (16 pins), FilterBoard.Schematic (32 pins), Output.Schematic (8 pins), FilterControl.Schematic (9 pins), MIDI.Schematic (6N139.?4 MIDI_THRU.2), Encodeurs.Schematic (12 pins)
NetC?#1_1: FilterBoard.Schematic (C?#1.1), Output.Schematic (U?#17.2), DAC.Schematic (C?#25.2)
NetR?#18_2: FilterBoard.Schematic (R?#18.2), Output.Schematic (U?#17.9)
NetR?#19_2: FilterBoard.Schematic (R?#19.2), Output.Schematic (U?#17.7)
NetR?#27_2: FilterBoard.Schematic (R?#27.2), Output.Schematic (U?#17.4)
NetR?#54_1: FilterBoard.Schematic (R?#54.1), FilterControl.Schematic (R?#91.1 U?#22.1)
NetR?#56_1: FilterBoard.Schematic (R?#56.1), FilterControl.Schematic (R?#92.1 R?#94.1 U?#23.1)
NetR?#62_1: FilterBoard.Schematic (R?#62.1), FilterControl.Schematic (R?#85.1 U?#21.1)